# Altium schematic sheet Gate.SchDoc
size A4; DocumentNumber: 7; SheetNumber: 7; SheetTotal: 7
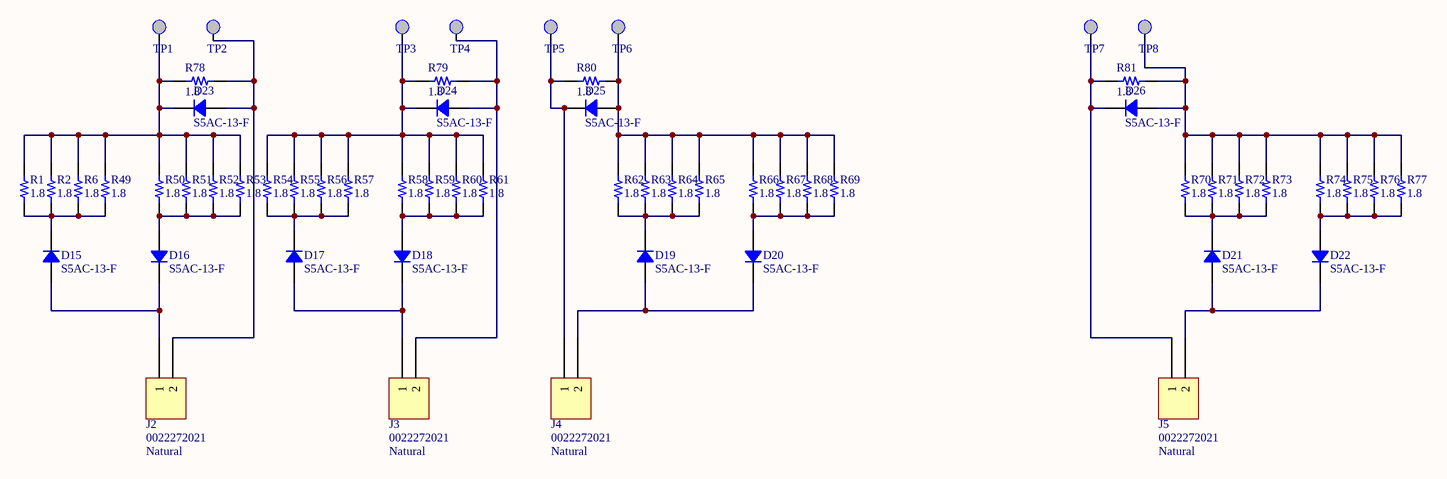
[diagram p0: Gate.SchDoc]

## Parts
D15  S5AC-13-F  [DO214AB SMC]
D16  S5AC-13-F  [DO214AB SMC]
D17  S5AC-13-F  [DO214AB SMC]
D18  S5AC-13-F  [DO214AB SMC]
D19  S5AC-13-F  [DO214AB SMC]
D20  S5AC-13-F  [DO214AB SMC]
D21  S5AC-13-F  [DO214AB SMC]
D22  S5AC-13-F  [DO214AB SMC]
D23  S5AC-13-F  [DO214AB SMC]
D24  S5AC-13-F  [DO214AB SMC]
D25  S5AC-13-F  [DO214AB SMC]
D26  S5AC-13-F  [DO214AB SMC]
J2  0022272021  Colour: Natural  [MOLEX KK 0022272021]
J3  0022272021  Colour: Natural  [MOLEX KK 0022272021]
J4  0022272021  Colour: Natural  [MOLEX KK 0022272021]
J5  0022272021  Colour: Natural  [MOLEX KK 0022272021]
R1  1.8  [RES 1206/3216]
R2  1.8  [RES 1206/3216]
R6  1.8  [RES 1206/3216]
R49  1.8  [RES 1206/3216]
R50  1.8  [RES 1206/3216]
R51  1.8  [RES 1206/3216]
R52  1.8  [RES 1206/3216]
R53  1.8  [RES 1206/3216]
R54  1.8  [RES 1206/3216]
R55  1.8  [RES 1206/3216]
R56  1.8  [RES 1206/3216]
R57  1.8  [RES 1206/3216]
R58  1.8  [RES 1206/3216]
R59  1.8  [RES 1206/3216]
R60  1.8  [RES 1206/3216]
R61  1.8  [RES 1206/3216]
R62  1.8  [RES 1206/3216]
R63  1.8  [RES 1206/3216]
R64  1.8  [RES 1206/3216]
R65  1.8  [RES 1206/3216]
R66  1.8  [RES 1206/3216]
R67  1.8  [RES 1206/3216]
R68  1.8  [RES 1206/3216]
R69  1.8  [RES 1206/3216]
R70  1.8  [RES 1206/3216]
R71  1.8  [RES 1206/3216]
R72  1.8  [RES 1206/3216]
R73  1.8  [RES 1206/3216]
R74  1.8  [RES 1206/3216]
R75  1.8  [RES 1206/3216]
R76  1.8  [RES 1206/3216]
R77  1.8  [RES 1206/3216]
R78  1.8  [RES 1206/3216]
R79  1.8  [RES 1206/3216]
R80  1.8  [RES 1206/3216]
R81  1.8  [RES 1206/3216]
TP1  Testpoint  [testpoint]  (value not drawn)  (no BOM)
TP2  Testpoint  [testpoint]  (value not drawn)  (no BOM)
TP3  Testpoint  [testpoint]  (value not drawn)  (no BOM)
TP4  Testpoint  [testpoint]  (value not drawn)  (no BOM)
TP5  Testpoint  [testpoint]  (value not drawn)  (no BOM)
TP6  Testpoint  [testpoint]  (value not drawn)  (no BOM)
TP7  Testpoint  [testpoint]  (value not drawn)  (no BOM)
TP8  Testpoint  [testpoint]  (value not drawn)  (no BOM)

## Nets
NetD15_1: D15.1 D16.2 J2.1
NetD15_2: D15.2 R1.1 R2.1 R6.1 R49.1
NetD16_1: D16.1 R50.1 R51.1 R52.1 R53.1
NetD17_1: D17.1 D18.2 J3.1
NetD17_2: D17.2 R54.1 R55.1 R56.1 R57.1
NetD18_1: D18.1 R58.1 R59.1 R60.1 R61.1
NetD19_1: D19.1 D20.2 J4.2
NetD19_2: D19.2 R62.1 R63.1 R64.1 R65.1
NetD20_1: D20.1 R66.1 R67.1 R68.1 R69.1
NetD21_1: D21.1 D22.2 J5.2
NetD21_2: D21.2 R70.1 R71.1 R72.1 R73.1
NetD22_1: D22.1 R74.1 R75.1 R76.1 R77.1
NetD23_1: D23.1 J2.2 R78.1 TP2.1
NetD23_2: D23.2 R1.2 R2.2 R6.2 R49.2 R50.2 R51.2 R52.2 R53.2 R78.2 TP1.1
NetD24_1: D24.1 J3.2 R79.1 TP4.1
NetD24_2: D24.2 R54.2 R55.2 R56.2 R57.2 R58.2 R59.2 R60.2 R61.2 R79.2 TP3.1
NetD25_1: D25.1 R62.2 R63.2 R64.2 R65.2 R66.2 R67.2 R68.2 R69.2 R80.1 TP6.1
NetD25_2: D25.2 J4.1 R80.2 TP5.1
NetD26_1: D26.1 R70.2 R71.2 R72.2 R73.2 R74.2 R75.2 R76.2 R77.2 R81.1 TP8.1
NetD26_2: D26.2 J5.1 R81.2 TP7.1

## Library data of the parts
D15-D26 = S5AC-13-F: DIODE GEN PURP 50V 5A SMC; Manufacturer: Diodes Incorporated; Type: Standard; Current Reverse Leakage @ Vr: 10uA @ 50V; Voltage Forward (Vf): 1.15V @ 5A; Part Number: S5AC-13-F; PartId: 16196; Supplier 1: Digi-Key; Supplier Part Number 1: S5AC-FDITR-ND; ComponentLink1Description: Datasheet; ComponentLink1URL: http://www.diodes.com/_files/datasheets/ds16007.pdf; ComponentLink2Description: Digi-Key Listing; ComponentLink2URL: https://www.digikey.com/product-detail/en/diodes-incorporated/S5AC-13-F/S5AC-FDITR-ND/770116; Junction Operating Temperature: -65C ~ 150C; Price: 0,132; Device Package: DO-214AB, SMC; Voltage DC Reverse (Vr): 50V; Current Rectified: 5A
J2-J5 = 0022272021: CONN HEADER 2POS .100 VERT TIN; Manufacturer: Molex, LLC; Pitch: 0.100" (2.54mm); Number Of Positions: 2; Part Number: 0022272021; PartId: 9719; Supplier 1: Digi-Key; Supplier Part Number 1: WM4111-ND; ComponentLink1Description: Datasheet; ComponentLink1URL: http://www.molex.com/pdm_docs/sd/022272021_sd.pdf; ComponentLink2Description: Digi-Key Listing; ComponentLink2URL: http://www.digikey.com/product-search/en?keywords=22-27-2021; Price: 0,25; Type: Header, Unshrouded; Contact Finish: Tin; Fastening Type: Friction Lock; Number Of Rows: 1; Series: KK 6410
R1 R2 R6 R49-R81 = ERJ-8GEYJ1R8V: RES SMD 1.8 OHM 5% 1/4W 1206; Manufacturer: Panasonic Electronic Components; TemperatureRange: -55C ~ 155C; TemperatureCoefficient: -100/ +600ppm/C; PowerRating: 0.25W, 1/4W; Value: 1.8; Part Number: ERJ-8GEYJ1R8V; PartId: 11976; Supplier 1: Digi-Key; Supplier Part Number 1: P1.8ETR-ND; ComponentLink1Description: Datasheet; ComponentLink1URL: http://industrial.panasonic.com/www-cgi/jvcr13pz.cgi?E+PZ+3+AOA0001+ERJ8GEYJ1R8V+7+WW; ComponentLink2Description: Digi-Key Listing; ComponentLink2URL: https://www.digikey.com/product-detail/en/panasonic-electronic-components/ERJ-8GEYJ1R8V/P1.8ETR-ND/282200; Tolerance: 5%; Price: 0,0045; Device Package: 1206 (3216 Metric)
TP1-TP8 = Testpoint: Digikey Part: *; Mouser Part: *